# EAGLE design Bike_Light (EAGLE 8.6.0)
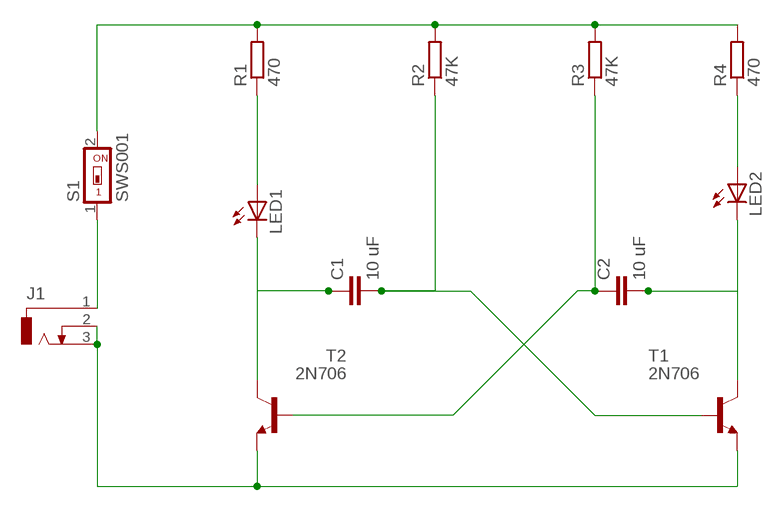
[diagram p0: schematic, sheet 1]

## Parts
C1  10 uF  C2,5-3  [C2.5-3]
C2  10 uF  C2,5-3  [C2.5-3]
J1  DCJ0303  [DCJ0303]
LED1  LED5MM  [LED5MM]
LED2  LED5MM  [LED5MM]
R1  470  R-EU_0207/10  [0207/10]
R2  47K  R-EU_0207/10  [0207/10]
R3  47K  R-EU_0207/10  [0207/10]
R4  470  R-EU_0207/10  [0207/10]
S1  SWS001  [SMS-001]
T1  2N706  [TO18]
T2  2N706  [TO18]

## Nets
N$1: R1.2 R2.2 R3.2 R4.2 S1.2
N$2: LED1.A R1.1
N$3: C1.1 LED1.K(C) T2.3(C)
N$4: C1.2 R2.1 T1.2(B)
N$5: C2.1 R3.1 T2.2(B)
N$6: LED2.A R4.1
N$7: C2.2 LED2.K(C) T1.3(C)
N$8: J1.1 S1.1
N$9: J1.2 J1.3 T1.1(E) T2.1(E)

## Library data of the parts
C1 C2 = capacitor-wima:C: CAPACITOR naming: grid - package width
J1 = con-jack:DCJ0303: DC POWER JACK Source: DCJ0303.pdf; OC_FARNELL: unknown; OC_NEWARK: unknown
LED1 LED2 = led:LED: LED OSRAM: - CHIPLED LG R971, LG N971, LY N971, LG Q971, LY Q971, LO R971, LY R971 LH N974, LH R974 LS Q976, LO Q976, LY Q976 LO Q996 - Hyper CHIPLED LW Q18S LB Q993, LB Q99A, LB R99A - SideLED LS A670, LO A670, LY A670, LG A670, LP A670 LB A673, LV A673, LT A673, LW A673 LH A674 LY A675 LS A676, LA A676, LO A676, LY A676, LW A676 LS A679, LY A679, LG A679 - Hyper Micro SIDELED® LS Y876, LA Y876, LO Y876, LY Y876 LT Y87S - SmartLED LW L88C, LW L88S LB L89C, LB L89S, LG L890 LS L89K, LO L89K, LY L89K LS L896, LA L896, LO L896, LY L896 - TOPLED LS T670, LO T670, LY T670, LG T670, LP T670 LSG T670, LSP T670, LSY T670, LOP T670, LYG T670 LG T671, LOG T671, LSG T671 LB T673, LV T673, LT T673, LW T673 LH T674 LS T676, LA T676, LO T676, LY T676, LB T676, LH T676, LSB T676, LW T676 LB T67C, LV T67C, LT T67C, LS T67K, LO T67K, LY T67K, LW E67C LS E67B, LA E67B, LO E67B, LY E67B, LB E67C, LV E67C, LT E67C LW T67C LS T679, LY T679, LG T679 LS T770, LO T770, LY T770, LG T770, LP T770 LB T773, LV T773, LT T773, LW T773 LH T774 LS E675, LA E675, LY E675, LS T675 LS T776, LA T776, LO T776, LY T776, LB T776 LHGB T686 LT T68C, LB T68C - Hyper Mini TOPLED® LB M676 - Mini TOPLED Santana® LG M470 LS M47K, LO M47K, LY M47K Source: http://www.osram.convergy.de LUXEON: - LUMILED® LXK2-PW12-R00, LXK2-PW12-S00, LXK2-PW14-U00, LXK2-PW14-V00 LXK2-PM12-R00, LXK2-PM12-S00, LXK2-PM14-U00 LXK2-PE12-Q00, LXK2-PE12-R00, LXK2-PE12-S00, LXK2-PE14-T00, LXK2-PE14-U00 LXK2-PB12-K00, LXK2-PB12-L00, LXK2-PB12-M00, LXK2-PB14-N00, LXK2-PB14-P00, LXK2-PB14-Q00 LXK2-PR12-L00, LXK2-PR12-M00, LXK2-PR14-Q00, LXK2-PR14-R00 LXK2-PD12-Q00, LXK2-PD12-R00, LXK2-PD12-S00 LXK2-PH12-R00, LXK2-PH12-S00 LXK2-PL12-P00, LXK2-PL12-Q00, LXK2-PL12-R00 Source: www.luxeon.com KINGBRIGHT: KA-3528ASYC Source: www.kingbright.com
R1-R4 = resistor:R-EU_: RESISTOR, European symbol
S1 = smd-special:SWS001: SMD Dip Switch 1 pol.
T1 T2 = transistor:2N706: NPN TRANSISTOR

## Board
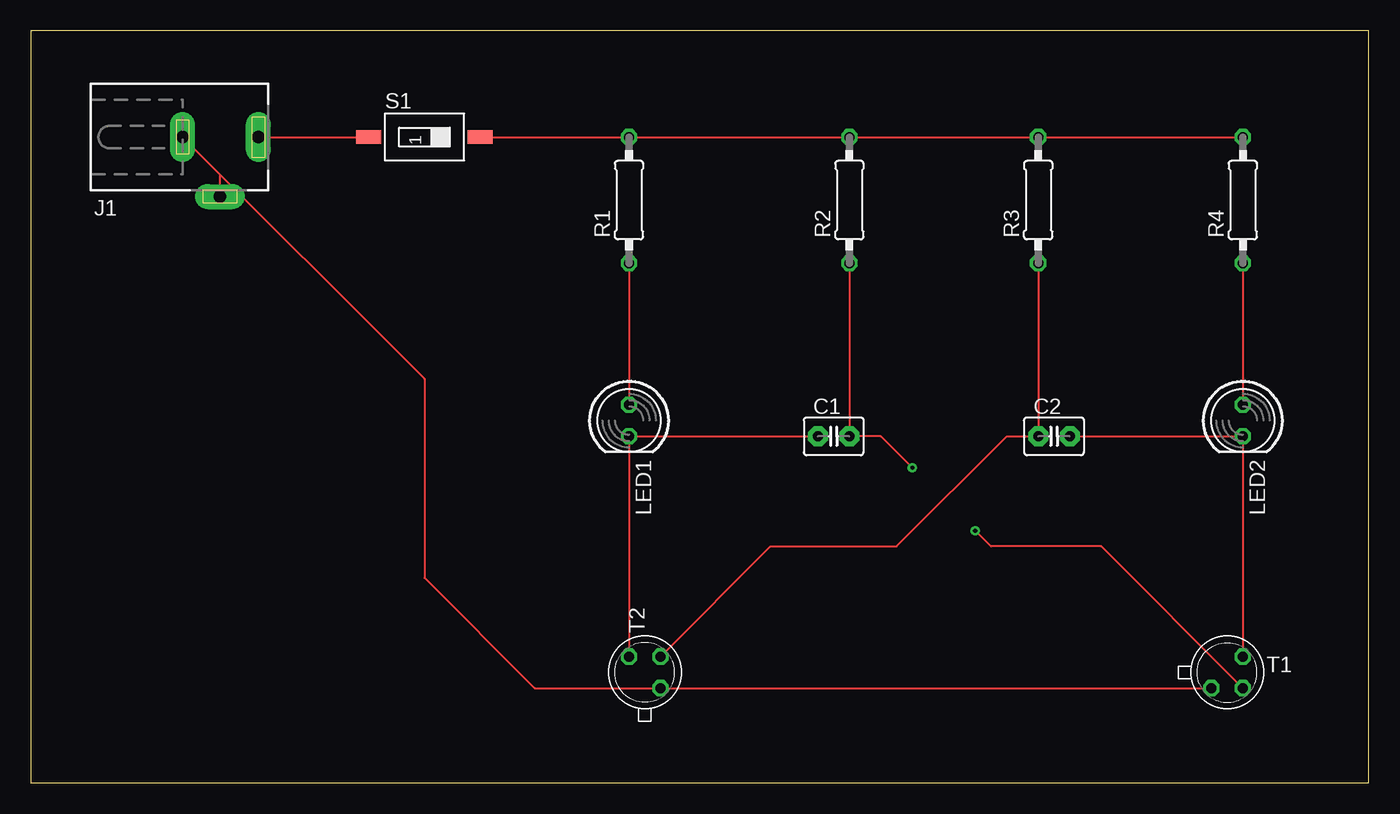
[diagram p1: board, top side]
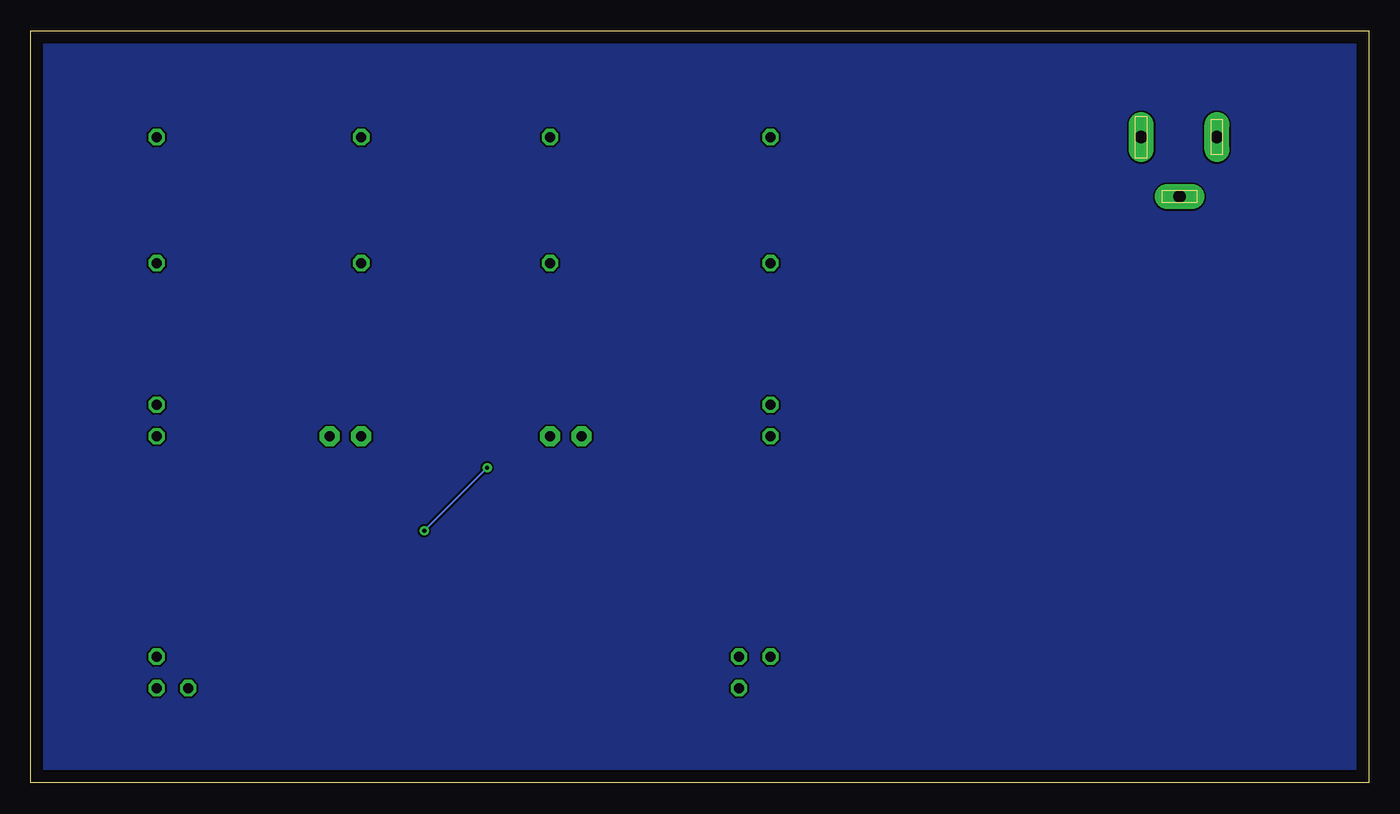
[diagram p2: board, bottom side, seen from below]

Size 107.93 x 60.63 mm. Coordinates in mm from the lower left corner, seen from the top.
Outline: 0,0 107.93,0 107.93,60.63 0,60.63 0,0
Copper layers (1*16): Top 0.035mm / dielectric 1.5mm / Bottom 0.035mm
Design rules "default": minimum track width 6mil, minimum drill 0.35mm, track to track 6mil, track to pad 6mil, pad to pad 6mil, via to via 6mil, smd to smd 6mil, copper to edge 40mil, drill to drill 6mil, minimum pad ring 10mil, minimum via ring 8mil, stop-mask expansion 4mil, vias tented up to drill 0mil, thermal gap 10mil

### Footprints (pad centres in the part's own frame; a part is rotated, then mirrored left to right if it is on the bottom)
C2.5-3 = drill 0.813 pad 1.6 octagon: 1 -1.27,0; 2 1.27,0
DCJ0303 = drill 1 pad 2 long: 1 0,3.1; 2 4.8,0; 3 0,-3
LED5MM = drill 0.813 octagon: A -1.27,0; K 1.27,0
0207/10 = drill 0.813 octagon: 1 -5.08,0; 2 5.08,0
SMS-001 = smd 1.092 x 2.007: 1 0,-4.496; 2 0,4.496
TO18 = drill 0.813 octagon: 1 -1.27,-1.27; 2 1.27,-1.27; 3 1.27,1.27

### Placement (x,y rotation side)
C1  64.77,27.94 0 top
C2  82.55,27.94 0 top
J1  15.24,52.07 270 top
LED1  48.26,29.21 270 top
LED2  97.79,29.21 270 top
R1  48.26,46.99 90 top
R2  66.04,46.99 90 top
R3  81.28,46.99 90 top
R4  97.79,46.99 90 top
S1  31.75,52.07 270 top
T1  96.52,8.89 0 top
T2  49.53,8.89 90 top

### Tracks (layer width: path | path; a pad name or v marks a point on that pad's centre or on a via)
N$1
  Top 0.152: S1.2 R1.2 R2.2 R3.2 R4.2
N$2
  Top 0.152: R1.1 LED1.A
N$3
  Top 0.152: C1.1 LED1.K T2.3
N$4  (via drill 0.35)
  Top 0.152: R2.1 C1.2 68.58,27.94 v71.12,25.4 | T1.2 86.36,19.05 77.47,19.05 v76.2,20.32
  Bottom 0.152: v76.2,20.32 v71.12,25.4
N$5
  Top 0.152: R3.1 C2.1 78.74,27.94 69.85,19.05 59.69,19.05 T2.2
N$6
  Top 0.152: R4.1 LED2.A
N$7
  Top 0.152: T1.3 LED2.K C2.2
N$8
  Top 0.152: J1.1 S1.1 27.94,52.07
N$9
  Top 0.152: T1.1 T2.1 40.64,7.62 31.75,16.51 31.75,32.56 J1.3 15.24,49.07 J1.2
N$10
  pour Bottom: 0,0 107.95,0 107.95,60.96 0,60.96